# Altium schematic sheet TM1638_10.SchDoc
size A4
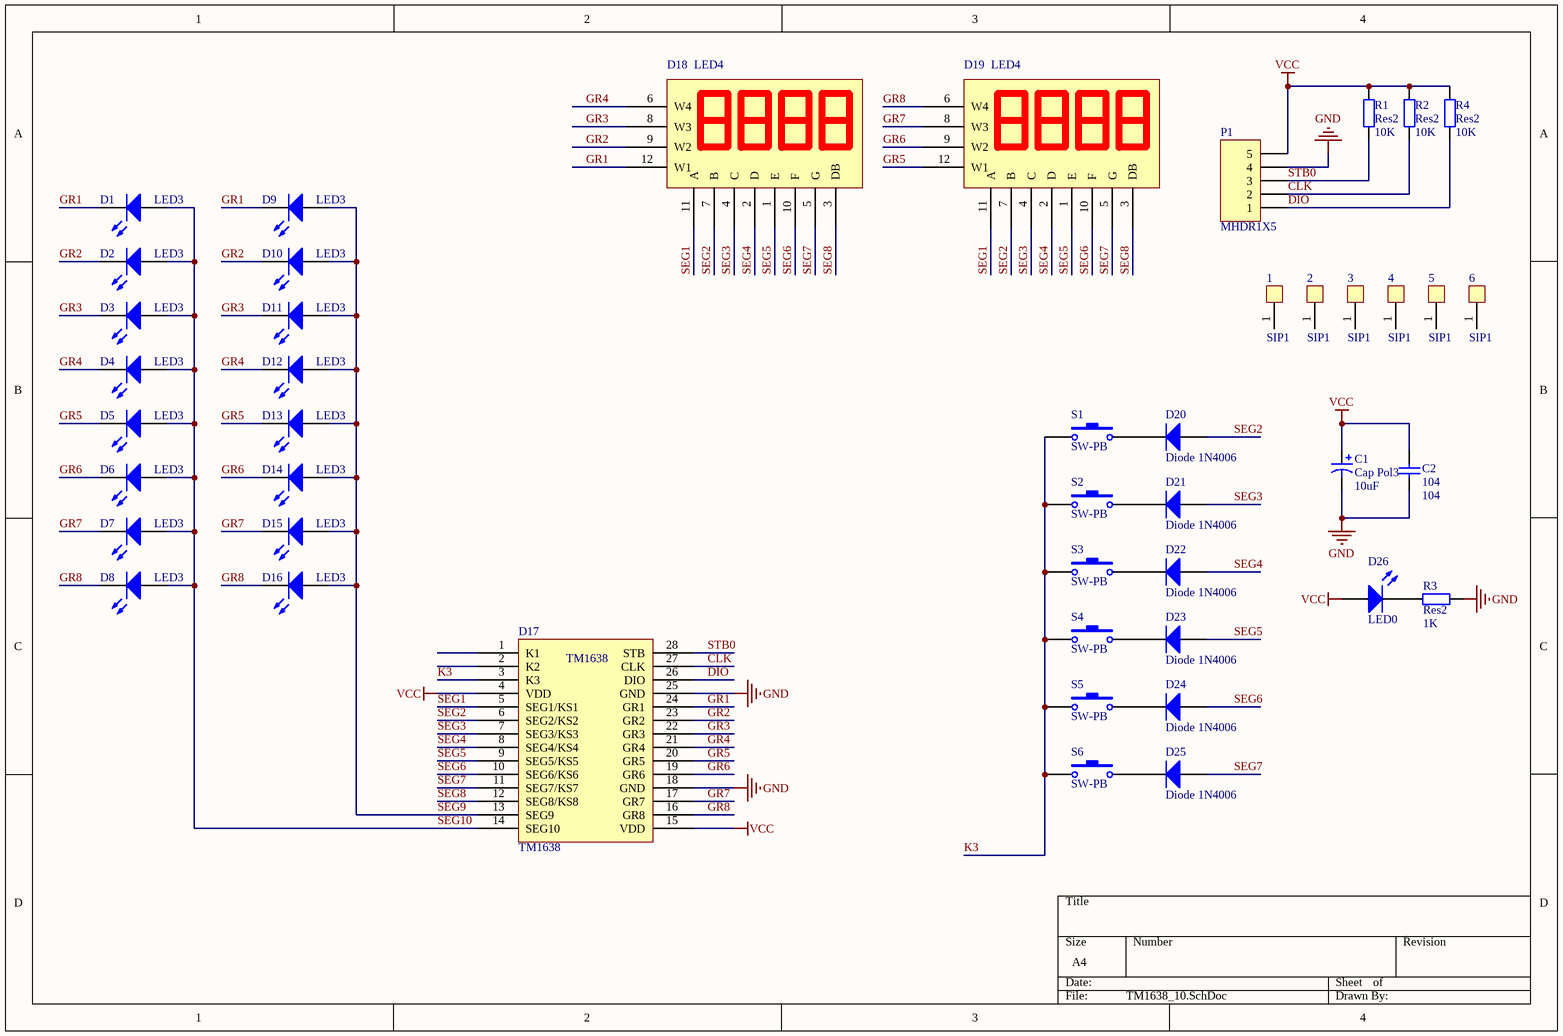
[diagram p0: TM1638_10.SchDoc]

## Parts
1  SIP1  [hole]
2  SIP1  [hole]
3  SIP1  [hole]
4  SIP1  [hole]
5  SIP1  [hole]
6  SIP1  [hole]
C1  Cap Pol3  value 10uF  [0805]
C2  104  [0805]
D1  LED3  [LED0]
D2  LED3  [LED0]
D3  LED3  [LED0]
D4  LED3  [LED0]
D5  LED3  [LED0]
D6  LED3  [LED0]
D7  LED3  [LED0]
D8  LED3  [LED0]
D9  LED3  [LED0]
D10  LED3  [LED0]
D11  LED3  [LED0]
D12  LED3  [LED0]
D13  LED3  [LED0]
D14  LED3  [LED0]
D15  LED3  [LED0]
D16  LED3  [LED0]
D17  TM1638  [SOP28]
D18  LED4  [LED4]
D19  LED4  [LED4]
D20  Diode 1N4006  [1N4148]
D21  Diode 1N4006  [1N4148]
D22  Diode 1N4006  [1N4148]
D23  Diode 1N4006  [1N4148]
D24  Diode 1N4006  [1N4148]
D25  Diode 1N4006  [1N4148]
D26  LED0  [LED0]
P1  MHDR1X5  [CON5]
R1  Res2  value 10K  [0805]
R2  Res2  value 10K  [0805]
R3  Res2  value 1K  [0805]
R4  Res2  value 10K  [0805]
S1  SW-PB  [key]
S2  SW-PB  [key]
S3  SW-PB  [key]
S4  SW-PB  [key]
S5  SW-PB  [key]
S6  SW-PB  [key]

## Nets
GND: C1.2 C2.1 D17.18(GND) D17.25(GND) P1.4 R3.1
VCC: C1.1 C2.2 D17.4(VDD) D17.15(VDD) D26.1(A) P1.5 R1.2 R2.2 R4.2
CLK: D17.27(CLK) P1.2 R2.1
DIO: D17.26(DIO) P1.1 R4.1
GR1: D1.2(K) D9.2(K) D17.24(GR1) D18.12(W1)
GR2: D2.2(K) D10.2(K) D17.23(GR2) D18.9(W2)
GR3: D3.2(K) D11.2(K) D17.22(GR3) D18.8(W3)
GR4: D4.2(K) D12.2(K) D17.21(GR4) D18.6(W4)
GR5: D5.2(K) D13.2(K) D17.20(GR5) D19.12(W1)
GR6: D6.2(K) D14.2(K) D17.19(GR6) D19.9(W2)
GR7: D7.2(K) D15.2(K) D17.17(GR7) D19.8(W3)
GR8: D8.2(K) D16.2(K) D17.16(GR8) D19.6(W4)
K3: D17.3(K3) S1.1 S2.1 S3.1 S4.1 S5.1 S6.1
SEG1: D17.5(SEG1/KS1) D18.11(A) D19.11(A)
SEG2: D17.6(SEG2/KS2) D18.7(B) D19.7(B) D20.1(A)
SEG3: D17.7(SEG3/KS3) D18.4(C) D19.4(C) D21.1(A)
SEG4: D17.8(SEG4/KS4) D18.2(D) D19.2(D) D22.1(A)
SEG5: D17.9(SEG5/KS5) D18.1(E) D19.1(E) D23.1(A)
SEG6: D17.10(SEG6/KS6) D18.10(F) D19.10(F) D24.1(A)
SEG7: D17.11(SEG7/KS7) D18.5(G) D19.5(G) D25.1(A)
SEG8: D17.12(SEG8/KS8) D18.3(DB) D19.3(DB)
SEG9: D9.1(A) D10.1(A) D11.1(A) D12.1(A) D13.1(A) D14.1(A) D15.1(A) D16.1(A) D17.13(SEG9)
SEG10: D1.1(A) D2.1(A) D3.1(A) D4.1(A) D5.1(A) D6.1(A) D7.1(A) D8.1(A) D17.14(SEG10)
STB0: D17.28(STB) P1.3 R1.1
NetD20_2: D20.2(K) S1.2
NetD21_2: D21.2(K) S2.2
NetD22_2: D22.2(K) S3.2
NetD23_2: D23.2(K) S4.2
NetD24_2: D24.2(K) S5.2
NetD25_2: D25.2(K) S6.2
NetD26_2: D26.2(K) R3.2

Not connected (* = marked no-connect by the designer): 1 1; 2 1; 3 1; 4 1; 5 1; 6 1; D17 1(K1) 2(K2)

## Library data of the parts
1-6 = SIP1: Variable Resistor; Set Position: 0.5; Published: 8-Jun-2000; LatestRevisionDate: 17-Jul-2002; LatestRevisionNote: Re-released for DXP Platform.; PackageReference: AXIAL-0.6; Publisher: Altium Limited
C1 = Cap Pol3: Polarized Capacitor (Surface Mount); Published: 8-Jun-2000; LatestRevisionDate: 29-May-2009; LatestRevisionNote: IPC-7351 Footprint Added.; PackageReference: C0805; Publisher: Altium Limited; PackageDescription: Chip Capacitor
C2 = Cap Semi: Capacitor (Semiconductor SIM Model); Published: 8-Jun-2000; LatestRevisionDate: 29-May-2009; LatestRevisionNote: IPC-7351 Footprint Added.; PackageReference: C1206; Publisher: Altium Limited; PackageDescription: Chip Capacitor; Value: 104
D1-D16 = LED3: Typical BLUE SiC LED; Published: 8-Jun-2000; LatestRevisionDate: 17-Dec-2003; LatestRevisionNote: PCB Footprint replaced.; DatasheetVersion: 16-Apr-2002; PackageVersion: 16-Apr-2002; PackageReference: 3.5X2.8X1.9; Publisher: Altium Limited; PackageDescription: SM LED; 2 C-Bend Leads; Body 3.5 x 2.8 x 1.9 mm, inc leads (LxWxH typ)
D18 D19 = LED_N4
D20-D25 = Diode 1N4006: 1 Amp General Purpose Rectifier; Published: 8-Jun-2000; LatestRevisionDate: 17-Jul-2002; LatestRevisionNote: Re-released for DXP Platform.; DatasheetVersion: 1998; PackageVersion: Aug-1999; PackageReference: DO-41; Publisher: Altium Limited; PackageDescription: Diode, Axial; Body 5.2 x 2.7 mm (LxDia. max), Lead Dia. 0.86 mm (max); Code_JEDEC: DO-204-AL; ComponentLink1Description: Manufacturer Link; ComponentLink1URL: http://www.fairchildsemi.com/; ComponentLink2Description: Datasheet; ComponentLink2URL: http://www.fairchildsemi.com/ds/1N%2F1N4001.pdf
D26 = LED0: Typical INFRARED GaAs LED; Published: 8-Jun-2000; LatestRevisionDate: 08-Jul-2005; LatestRevisionNote: Mech Layer 1 removed.; PackageReference: LED-0; Publisher: Altium Limited; PackageDescription: LED; 2 Leads
P1 = MHDR1X5: Header, 5-Pin; LatestRevisionDate: 17-Jul-2002; LatestRevisionNote: Re-released for DXP Platform.; Publisher: Altium Limited
R1-R4 = Res2: Resistor; Published: 8-Jun-2000; LatestRevisionDate: 17-Jul-2002; LatestRevisionNote: Re-released for DXP Platform.; PackageReference: AXIAL-0.4; Publisher: Altium Limited; PackageDescription: Axial Device, Thru-Hole; 2 Leads; 0.4 in Pin Spacing
S1-S6 = SW-PB: Switch; Published: 24-Mar-1999; LatestRevisionDate: 17-Jul-2002; LatestRevisionNote: Re-released for DXP Platform.; PackageReference: SPST-2; Publisher: Altium Limited; PackageDescription: Switch; 2 Leads